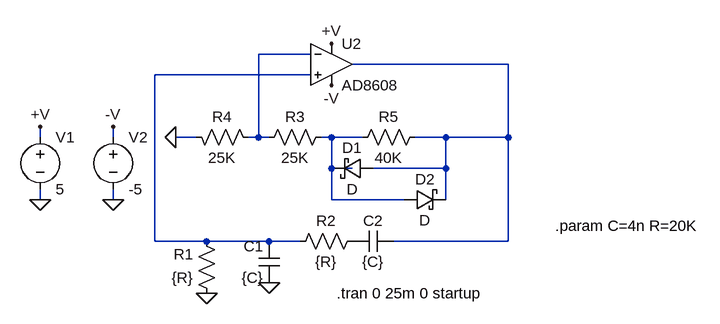
[diagram p0: schematic wein.asc]
wein.asc, the LTspice schematic file:
Version 4.1
SHEET 1 952 1108
WIRE 128 192 48 192
WIRE 432 208 192 208
WIRE 128 224 -112 224
WIRE -288 320 -288 304
WIRE -176 320 -176 304
WIRE -48 320 -80 320
WIRE 48 320 48 192
WIRE 48 320 32 320
WIRE 64 320 48 320
WIRE 160 320 144 320
WIRE 208 320 160 320
WIRE 336 320 288 320
WIRE 432 320 432 208
WIRE 432 320 336 320
WIRE 160 368 160 320
WIRE 192 368 160 368
WIRE 336 368 336 320
WIRE 336 368 224 368
WIRE -288 416 -288 400
WIRE -176 416 -176 400
WIRE 160 416 160 368
WIRE 272 416 160 416
WIRE 336 416 336 368
WIRE -112 480 -112 224
WIRE -32 480 -112 480
WIRE 64 480 -32 480
WIRE 112 480 64 480
WIRE 432 480 432 320
WIRE 432 480 256 480
FLAG 160 176 +V
FLAG 160 240 -V
FLAG -288 304 +V
FLAG -176 416 0
FLAG -288 416 0
FLAG -176 304 -V
FLAG -80 320 0
FLAG -32 560 0
FLAG 64 544 0
SYMBOL voltage -288 304 R0
WINDOW 123 0 0 Left 0
WINDOW 39 0 0 Left 0
SYMATTR InstName V1
SYMATTR Value 5
SYMBOL voltage -176 304 R0
WINDOW 123 0 0 Left 0
WINDOW 39 0 0 Left 0
SYMATTR InstName V2
SYMATTR Value -5
SYMBOL res 208 464 R90
WINDOW 0 0 56 VBottom 2
WINDOW 3 32 56 VTop 2
SYMATTR InstName R2
SYMATTR Value {R}
SYMBOL res 160 304 R90
WINDOW 0 0 56 VBottom 2
WINDOW 3 32 56 VTop 2
SYMATTR InstName R3
SYMATTR Value 25K
SYMBOL res -64 304 M90
WINDOW 0 0 56 VBottom 2
WINDOW 3 32 56 VTop 2
SYMATTR InstName R4
SYMATTR Value 25K
SYMBOL cap 80 544 R180
WINDOW 0 24 56 Left 2
WINDOW 3 24 8 Left 2
SYMATTR InstName C1
SYMATTR Value {C}
SYMBOL cap 256 464 R90
WINDOW 0 0 32 VBottom 2
WINDOW 3 32 32 VTop 2
SYMATTR InstName C2
SYMATTR Value {C}
SYMBOL res -16 576 R180
WINDOW 0 36 76 Left 2
WINDOW 3 36 40 Left 2
SYMATTR InstName R1
SYMATTR Value {R}
SYMBOL res 304 304 R90
WINDOW 0 0 56 VBottom 2
WINDOW 3 32 56 VTop 2
SYMATTR InstName R5
SYMATTR Value 40K
SYMBOL OpAmps\\AD8608 160 144 R0
SYMATTR InstName U2
SYMBOL schottky 224 352 R90
WINDOW 0 0 32 VBottom 2
WINDOW 3 32 32 VTop 2
SYMATTR InstName D1
SYMBOL schottky 272 432 R270
WINDOW 0 32 32 VTop 2
WINDOW 3 0 32 VBottom 2
SYMATTR InstName D2
TEXT 168 560 Left 2 !.tran 0 25m 0 startup
TEXT 504 456 Left 2 !.param C=4n R=20K

The netlist it stands for:
* wein.asc
V1 +V 0 5
V2 -V 0 -5
R2 P001 N003 {R}
R3 N004 N001 25K
R4 0 N001 25K
C1 0 N003 {C}
C2 N002 P001 {C}
R1 0 N003 {R}
R5 N002 N004 40K
X§U2 N003 N001 +V -V N002 AD8608  ; pins In+ In- V+ V- OUT
D1 N002 N004 D
D2 N004 N002 D
.model D D
.lib standard.dio
.tran 0 25m 0 startup
.param C=4n R=20K
.backanno
.end

* Results of the author's LTspice run, read from the files saved beside the schematic
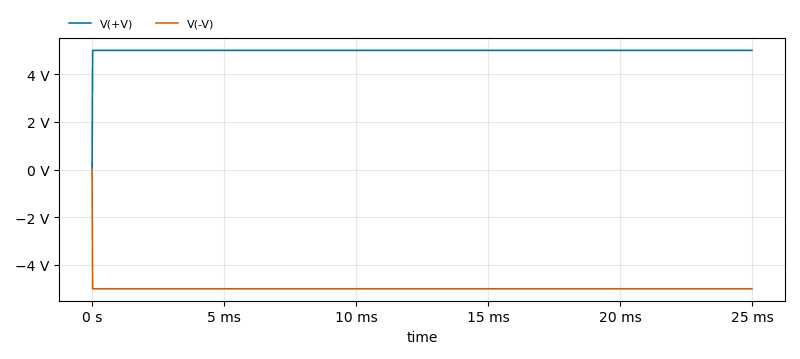
[diagram p1: Transient Analysis of wein.asc, plotted from the saved traces]
* Transient Analysis, 1 run:
*   V(+V): min 0 V, max 5 V, average 4.998 V, rms 4.999 V, last 5 V
*   V(-V): min -5 V, max 0 V, average -4.998 V, rms 4.999 V, last -5 V